# Altium schematic sheet MSP-EXP430F5529LP_1.SchDoc: MSP-EXP430F5529LP
size 286 x 199 mm; Date: 2015/6/22 13:08:34; SheetNumber: 2; Origin: Eagle; GateName_1: G$1; SymbolName_1: DINA4_L; LibraryName: MSP-EXP430F5659; DeviceSetName: DINA4_L; GateName_2: G$2; SymbolName_2: DOCFIELD; Sheet: Sheet:; REV: REV:
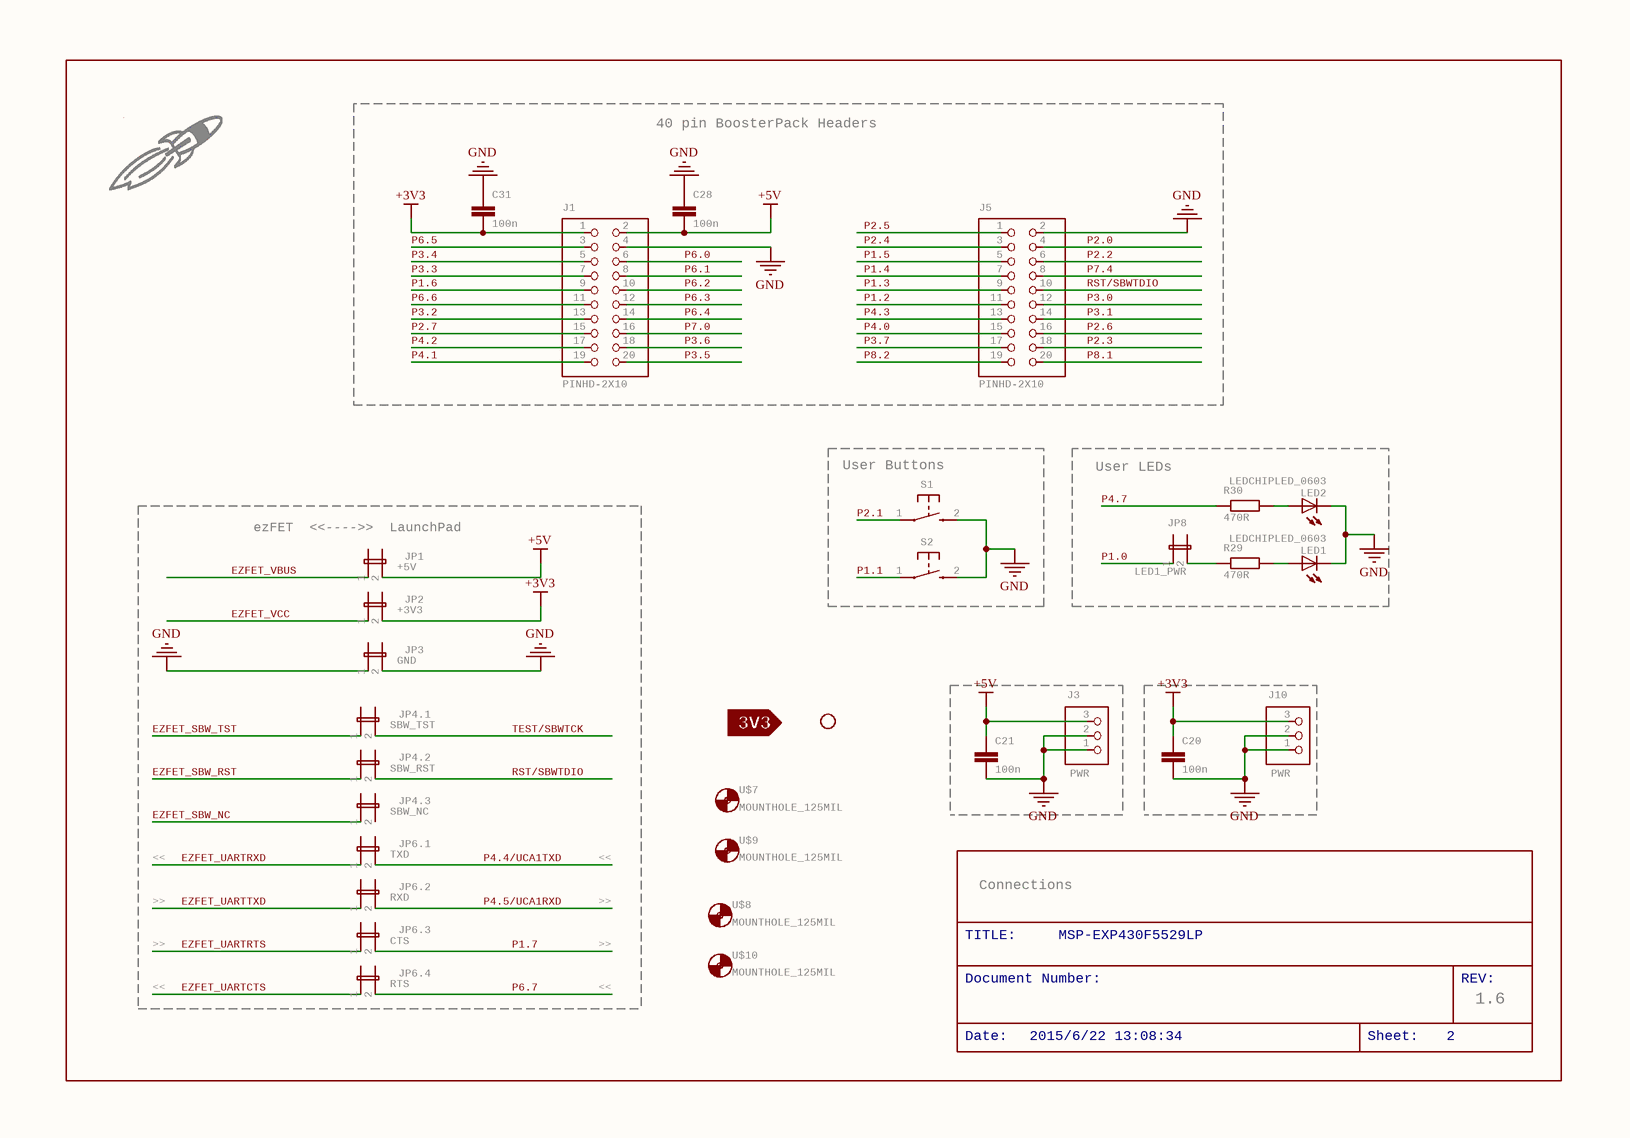
[diagram p0: MSP-EXP430F5529LP_1.SchDoc]

## Parts
C20  100n  [0402]
C21  100n  [0402]
C28  100n  [0402]
C31  100n  [0402]
DRAW1  LOGO-ROCKET-20X13MM-SCH-S  [LOGO-ROCKET-10X7MM-BRD]  (value not drawn)
J1  PINHD-2X10  [2X10]
J3  PWR  [1X03]
J5  PINHD-2X10  [2X10]
J10  PWR  [1X03]
JP1  +5V  [JP1M]
JP2  +3V3  [JP1M]
JP3  GND  [JP1M]
JP4.1  SBW_TST  [JP1M]
JP4.2  SBW_RST  [JP1M]
JP4.3  SBW_NC  [JP1M]
JP6.1  TXD  [JP1M]
JP6.2  RXD  [JP1M]
JP6.3  CTS  [JP1M]
JP6.4  RTS  [JP1M]
JP8  LED1_PWR  [JP1]
LED1  LEDCHIPLED_0603  [CHIPLED_0603]
LED2  LEDCHIPLED_0603  [CHIPLED_0603]
R29  470R  [0402]
R30  470R  [0402]
S1  PB  [PBTH]  (value not drawn)
S2  PB  [PBTH]  (value not drawn)
U$4  MS_TM  [MS_TM]  (value not drawn)
U$6  SILK_3V3_TAG  [SILK_3V3_TAG]  (value not drawn)
U$7  MOUNTHOLE_125MIL  [MOUNTHOLE_125MIL]
U$8  MOUNTHOLE_125MIL  [MOUNTHOLE_125MIL]
U$9  MOUNTHOLE_125MIL  [MOUNTHOLE_125MIL]
U$10  MOUNTHOLE_125MIL  [MOUNTHOLE_125MIL]
U$11  5529LP_REARSILK_REV1_6  [5529LP_REARSILK_REV1_6]  (value not drawn)

## Blocks framed on the sheet
40 pin BoosterPack Headers: C28 C31 J1 J5
User Buttons: S1 S2
User LEDs: JP8 LED1 LED2 R29 R30
ezFET  <<---->>  LaunchPad: JP1-JP3 JP4.1-JP4.3 JP6.1-JP6.4

## Nets
+3V3: C20.1 C31.2 J1.1 J10.3 JP2.2
+5V: C21.1 C28.2 J1.2 J3.3 JP1.2
GND: C20.2 C21.2 C28.1 C31.1 J1.4 J3.1 J3.2 J5.2 J10.1 J10.2 JP3.1 JP3.2 LED1.C LED2.C S1.2(S) S2.2(S)
EZFET_SBW_NC: JP4.3.1
EZFET_SBW_RST: JP4.2.1
EZFET_SBW_TST: JP4.1.1
EZFET_UARTCTS: JP6.4.1
EZFET_UARTRTS: JP6.3.1
EZFET_UARTRXD: JP6.1.1
EZFET_UARTTXD: JP6.2.1
EZFET_VBUS: JP1.1
EZFET_VCC: JP2.1
P1.0: JP8.1
P1.1: S2.1(P)
P1.2: J5.11
P1.3: J5.9
P1.4: J5.7
P1.5: J5.5
P1.6: J1.9
P1.7: JP6.3.2
P2.0: J5.4
P2.1: S1.1(P)
P2.2: J5.6
P2.3: J5.18
P2.4: J5.3
P2.5: J5.1
P2.6: J5.16
P2.7: J1.15
P3.0: J5.12
P3.1: J5.14
P3.2: J1.13
P3.3: J1.7
P3.4: J1.5
P3.5: J1.20
P3.6: J1.18
P3.7: J5.17
P4.0: J5.15
P4.1: J1.19
P4.2: J1.17
P4.3: J5.13
P4.4/UCA1TXD: JP6.1.2
P4.5/UCA1RXD: JP6.2.2
P4.7: R30.1
P6.0: J1.6
P6.1: J1.8
P6.2: J1.10
P6.3: J1.12
P6.4: J1.14
P6.5: J1.3
P6.6: J1.11
P6.7: JP6.4.2
P7.0: J1.16
P7.4: J5.8
P8.1: J5.20
P8.2: J5.19
RST/SBWTDIO: J5.10 JP4.2.2
TEST/SBWTCK: JP4.1.2
NetJP8_2: JP8.2 R29.1
NetLED1_A: LED1.A R29.2
NetLED2_A: LED2.A R30.2

Not connected (* = marked no-connect by the designer): JP4.3 2

## Notes on the sheet
- <<
- >>
- TITLE:
- Connections
- MSP-EXP430F5529LP
- Document Number:
- REV:
- 1.6
- Date:
- 2015/6/22 13:08:34
- Sheet:
- 2

## Library data of the parts
C20 C21 C28 C31 = C-EUCM0402: CAPACITOR, European symbol; GateName_1: G$1; SymbolName_1: C-EU; DeviceName: CM0402; LibraryName: rcl; DeviceSetName: C-EU
DRAW1 = LOGO-ROCKET-20X13MM-SCH-S: TI LaunchPad Rocket for Schematic and Layout   Based on TI's LaunchPad Rocket from www.ti.com/LaunchPad   Usage:  Place this component in the Eagle Schematic  This symbol has a footprint too, so it will show up in the layout too  There are different sizes / footprints available  The PCB symbol size can be changed via package in schematic or the layout       As far as I know the LaunchPad rocket is released by TI under the Creative Commons license.    Check for updates and leave me feedback: github.com/ucdude  Happy hacking - ucDude, Nov 2012; GateName_1: G$1; SymbolName_1: LOGO-ROCKET-20X13MM-SYM; DeviceName: -S; LibraryName: TI-LaunchPad-Eagle; DeviceSetName: LOGO-ROCKET-20X13MM-SCH
J1 J5 = PINHD-2X10: PIN HEADER; GateName_1: A; SymbolName_1: PINH2X10; LibraryName: pinhead; DeviceSetName: PINHD-2X10
J3 J10 = PINHD-1X3: PIN HEADER; GateName_1: A; SymbolName_1: PINHD3; LibraryName: pinhead; DeviceSetName: PINHD-1X3
JP1-JP3 JP4.1-JP4.3 JP6.1-JP6.4 = JP1M: GateName_1: G$1; SymbolName_1: JP2E; LibraryName: jumper; DeviceSetName: JP1M
JP8 = JP1E: JUMPER; GateName_1: A; SymbolName_1: JP2E; LibraryName: jumper; DeviceSetName: JP1E
LED1 LED2 = LEDCHIPLED_0603: LED   OSRAM: - CHIPLED LG R971, LG N971, LY N971, LG Q971, LY Q971, LO R971, LY R971 LH N974, LH R974 LS Q976, LO Q976, LY Q976 LO Q996 - Hyper CHIPLED LW Q18S LB Q993, LB Q99A, LB R99A - SideLED LS A670, LO A670, LY A670, LG A670, LP A670 LB A673, LV A673, LT A673, LW A673 LH A674 LY A675 LS A676, LA A676, LO A676, LY A676, LW A676 LS A679, LY A679, LG A679 -  Hyper Micro SIDELED庐 LS Y876, LA Y876, LO Y876, LY Y876 LT Y87S - SmartLED LW L88C, LW L88S LB L89C, LB L89S, LG L890 LS L89K, LO L89K, LY L89K LS L896, LA L896, LO L896, LY L896 - TOPLED LS T670, LO T670, LY T670, LG T670, LP T670 LSG T670, LSP T670, LSY T670, LOP T670, LYG T670 LG T671, LOG T671, LSG T671 LB T673, LV T673, LT T673, LW T673 LH T674 LS T676, LA T676, LO T676, LY T676, LB T676, LH T676, LSB T676, LW T676 LB T67C, LV T67C, LT T67C, LS T67K, LO T67K, LY T67K, LW E67C LS E67B, LA E67B, LO E67B, LY E67B, LB E67C, LV E67C, LT E67C LW T67C LS T679, LY T679, LG T679 LS T770, LO T770, LY T770, LG T770, LP T770 LB T773, LV T773, LT T773, LW T773 LH T774 LS E675, LA E675, LY E675, LS T675 LS T776, LA T776, LO T776, LY T776, LB T776 LHGB T686 LT T68C, LB T68C - Hyper Mini TOPLED庐 LB M676 - Mini TOPLED Santana庐 LG M470 LS M47K, LO M47K, LY M47K    Source: http://www.osram.convergy.de   LUXEON: - LUMILED庐 LXK2-PW12-R00, LXK2-PW12-S00, LXK2-PW14-U00, LXK2-PW14-V00 LXK2-PM12-R00, LXK2-PM12-S00, LXK2-PM14-U00 LXK2-PE12-Q00, LXK2-PE12-R00, LXK2-PE12-S00, LXK2-PE14-T00, LXK2-PE14-U00 LXK2-PB12-K00, LXK2-PB12-L00, LXK2-PB12-M00, LXK2-PB14-N00, LXK2-PB14-P00, LXK2-PB14-Q00 LXK2-PR12-L00, LXK2-PR12-M00, LXK2-PR14-Q00, LXK2-PR14-R00 LXK2-PD12-Q00, LXK2-PD12-R00, LXK2-PD12-S00 LXK2-PH12-R00, LXK2-PH12-S00 LXK2-PL12-P00, LXK2-PL12-Q00, LXK2-PL12-R00    Source: www.luxeon.com   KINGBRIGHT:   KA-3528ASYC Source: www.kingbright.com; GateName_1: G$1; SymbolName_1: LED; DeviceName: CHIPLED_0603; LibraryName: led; DeviceSetName: LED
R29 R30 = R-EU_RM0402: RESISTOR, European symbol; GateName_1: G$1; SymbolName_1: R-EU; DeviceName: RM0402; DeviceSetName: R-EU_; LibraryName: rcl
S1 S2 = PB: OMRON SWITCH; GateName_1: G$1; SymbolName_1: PB; LibraryName: electricalmeter; DeviceSetName: PB
U$4 = MS_TM: GateName_1: G$1; SymbolName_1: SILKSCREEN; LibraryName: LP_Silkscreen; DeviceSetName: MS_TM
U$6 = SILK_3V3_TAG: GateName_1: G$1; SymbolName_1: 3V3_TAG; LibraryName: MSP-EXP432; DeviceSetName: SILK_3V3_TAG
U$7-U$10 = MOUNTHOLE_125MIL: GateName_1: A; SymbolName_1: MOUNTHOLE_125MIL; LibraryName: MSP-EXP432; DeviceSetName: MOUNTHOLE_125MIL
U$11 = 5529LP_REARSILK_REV1_6: GateName_1: G$1; SymbolName_1: SILK; LibraryName: Silk; DeviceSetName: 5529LP_REARSILK_REV1_6